# EAGLE design Cap_array_with_Current_Limiter_V1p0 (EAGLE 9.6.2)
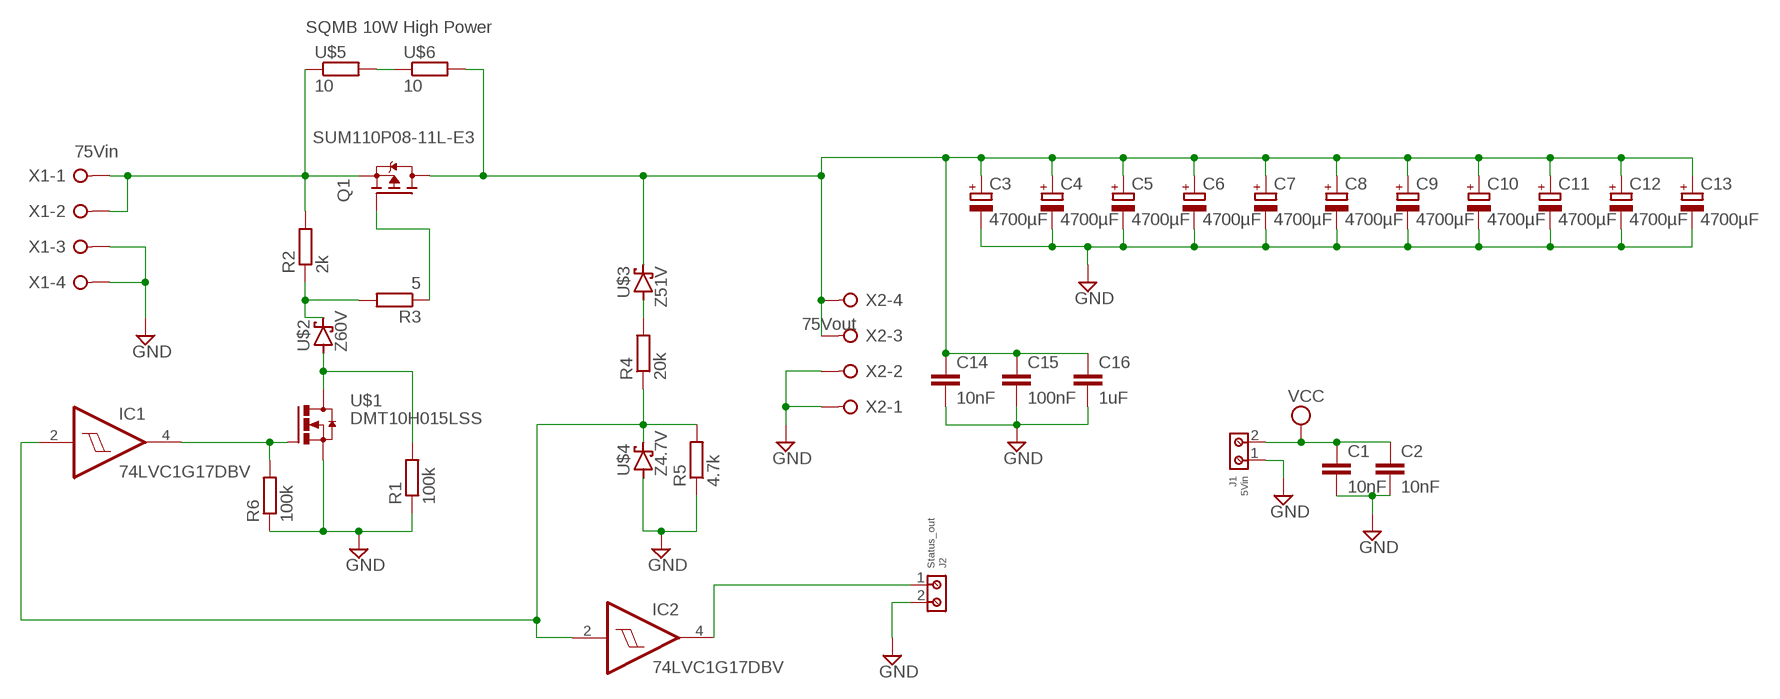
[diagram p0: schematic, sheet 1]

## Parts
C1  10nF  C-EUC0805  [C0805]
C2  10nF  C-EUC0805  [C0805]
C3  4700µF  CPOL-EUE10-30  [EB30D]
C4  4700µF  CPOL-EUE10-30  [EB30D]
C5  4700µF  CPOL-EUE10-30  [EB30D]
C6  4700µF  CPOL-EUE10-30  [EB30D]
C7  4700µF  CPOL-EUE10-30  [EB30D]
C8  4700µF  CPOL-EUE10-30  [EB30D]
C9  4700µF  CPOL-EUE10-30  [EB30D]
C10  4700µF  CPOL-EUE10-30  [EB30D]
C11  4700µF  CPOL-EUE10-30  [EB30D]
C12  4700µF  CPOL-EUE10-30  [EB30D]
C13  4700µF  CPOL-EUE10-30  [EB30D]
C14  10nF  C-EUC1206  [C1206]
C15  100nF  C-EUC1206  [C1206]
C16  1uF  C-EUC1206  [C1206]
IC1  74LVC1G17DBV  [SOT23-5]
IC2  74LVC1G17DBV  [SOT23-5]
J1  5Vin  691210910002  [691210910002]
J2  Status_out  691210910002  [691210910002]
Q1  SUM110P08-11L-E3  SPB80P06P  [TO263]
R1  100k  R-EU_R0805  [R0805]
R2  2k  R-EU_R2512  [R2512]
R3  5  R-EU_R0805  [R0805]
R4  20k  R-EU_R0805  [R0805]
R5  4.7k  R-EU_R0805  [R0805]
R6  100k  R-EU_R0805  [R0805]
U$1  DMT10H015LSS  [SOIC8]
U$2  Z60V  SCHOTTKYDO-214-AA  [DO-214AA]
U$3  Z51V  SCHOTTKYDO-214-AA  [DO-214AA]
U$4  Z4.7V  SCHOTTKYDO-214-AA  [DO-214AA]
U$5  10  SQMB  [SQMB]
U$6  10  SQMB  [SQMB]
X1  75Vin  W237-04P  [W237-4P]
X2  75Vout  W237-04P  [W237-4P]

## Nets
GND: C1.2 C2.2 C3.- C4.- C5.- C6.- C7.- C8.- C9.- C10.- C11.- C12.- C13.- C14.2 C15.2 C16.2 J1.1 J2.2 R1.1 R5.1 R6.1 U$1.1(S) U$1.2(S) U$1.3(S) U$4.A X1.3 X1.4 X2.1 X2.2
N$1: R2.1 R3.2 U$2.C
N$2: Q1.2(S) R2.2 U$5.P$1 X1.1 X1.2
N$3: U$5.P$2 U$6.P$1
N$6: IC1.4(O) R6.2 U$1.4(G)
N$7: Q1.1(G) R3.1
N$8: C3.+ C4.+ C5.+ C6.+ C7.+ C8.+ C9.+ C10.+ C11.+ C12.+ C13.+ C14.1 C15.1 C16.1 Q1.3(D) U$3.C U$6.P$2 X2.3 X2.4
N$9: R4.2 U$3.A
N$10: IC1.2(I) IC2.2(I) R4.1 R5.2 U$4.C
N$15: IC2.4(O) J2.1
N$40: R1.2 U$1.5(D) U$1.6(D) U$1.7(D) U$1.8(D) U$2.A
VCC: C1.1 C2.1 J1.2

## Notes on the sheet
- SQMB 10W High Power

## Power pins joined to a net without a drawn wire
GND: IC1.3(GND) IC2.3(GND)
VCC: IC1.5(VCC) IC2.5(VCC)

## Library data of the parts
C1 C2 C14-C16 = rcl:C-EU: CAPACITOR, European symbol; SPICEPREFIX: C
C3-C13 = rcl:CPOL-EU: POLARIZED CAPACITOR, European symbol; SPICEPREFIX: C
IC1 IC2 = 74xx-little-us:74*1G17: Single Schmitt-Trigger Buffer
J1 J2 = Wurth_Connectors_WR-TBL Rising Cage Clamp:691210910002: WR-TBL Serie 2109 - 2.54 mm Horiz. Entry KIND PROPERTIES Pitch 2.54 mm MATERIAL PROPERTIES Insulator Material PA66 Insulator Flammability Rating UL94 V-0 Insulator Color Green Contact Material Brass Contact Plating Copper over Zinc Terminal Screw Material Steel Terminal Screw Plating Zinc Wire Guard Material Brass GENERAL INFORMATION Operating Temperature -40 up to +105 °C Compliance Lead free / RoHS ELECTRICAL PROPERTIES IR cULus 6 A Working Voltage [cULus] 150 V (AC) Withstanding Voltage [cULus] 1300 V (AC) Contact Resistance [cULus] 20 mΩ MECHANICAL PROPERTIES Wire Strip Length 4 up to 5 (mm) Screw M1.6 Solid Wire Section (AWG) 30 to 18 (AWG) Solid Wire Section (Metric) 0.0509 to 0.823 (mm²) Stranded Wire Section (AWG) 30 to 18 (AWG) Stranded Wire Section (Metric) 0.0509 to 0.823 (mm²) CERTIFICATION cULus Approval E315414 PACKAGING PROPERTIES Packaging Box <https://katalog.we-online.com/media/images/v2/o33231v209%20Family_WR-TBL_69121091000x.jpg> Details see: https://katalog.we-online.com/en/em/TBL_2_54_2109_HORIZONTAL_ENTRY_69121091000X Updated by Ella Wu 2019-11-12 2019(C) Wurth Elektronik; DATASHEET-URL: https://www.we-online.com/catalog/datasheet/691210910002.pdf; IR-UL: 6A; MOUNT: THT; PART-NUMBER: 691210910002; PINS: 2; PITCH: 2.54mm; TYPE: Horizontal; WIRE: 30 to 18 (AWG) 0.0509 to 0.823 (mm²); WORKING-VOLTAGE-UL: 150V (AC)
Q1 = transistor-fet:SPB80P06P: SIPMOS (R) Power-Transistor P-Channel, Enhancement mode Source: http://www.infineon.com/upload/Document/cmc_upload/documents/011/3685/SPP80P06P.pdf
R1-R6 = rcl:R-EU_: RESISTOR, European symbol; SPICEPREFIX: R
U$1 = Orzada:DMT10H015LSS
U$2-U$4 = Orzada:SCHOTTKY
U$5 U$6 = Orzada:SQMB: SQMB Cement Housed High Power Resistor - Pulse Withstand
X1 X2 = con-wago-508:W237-04P: WAGO SREW CLAMP; OC_FARNELL: unknown; OC_NEWARK: unknown

## Board
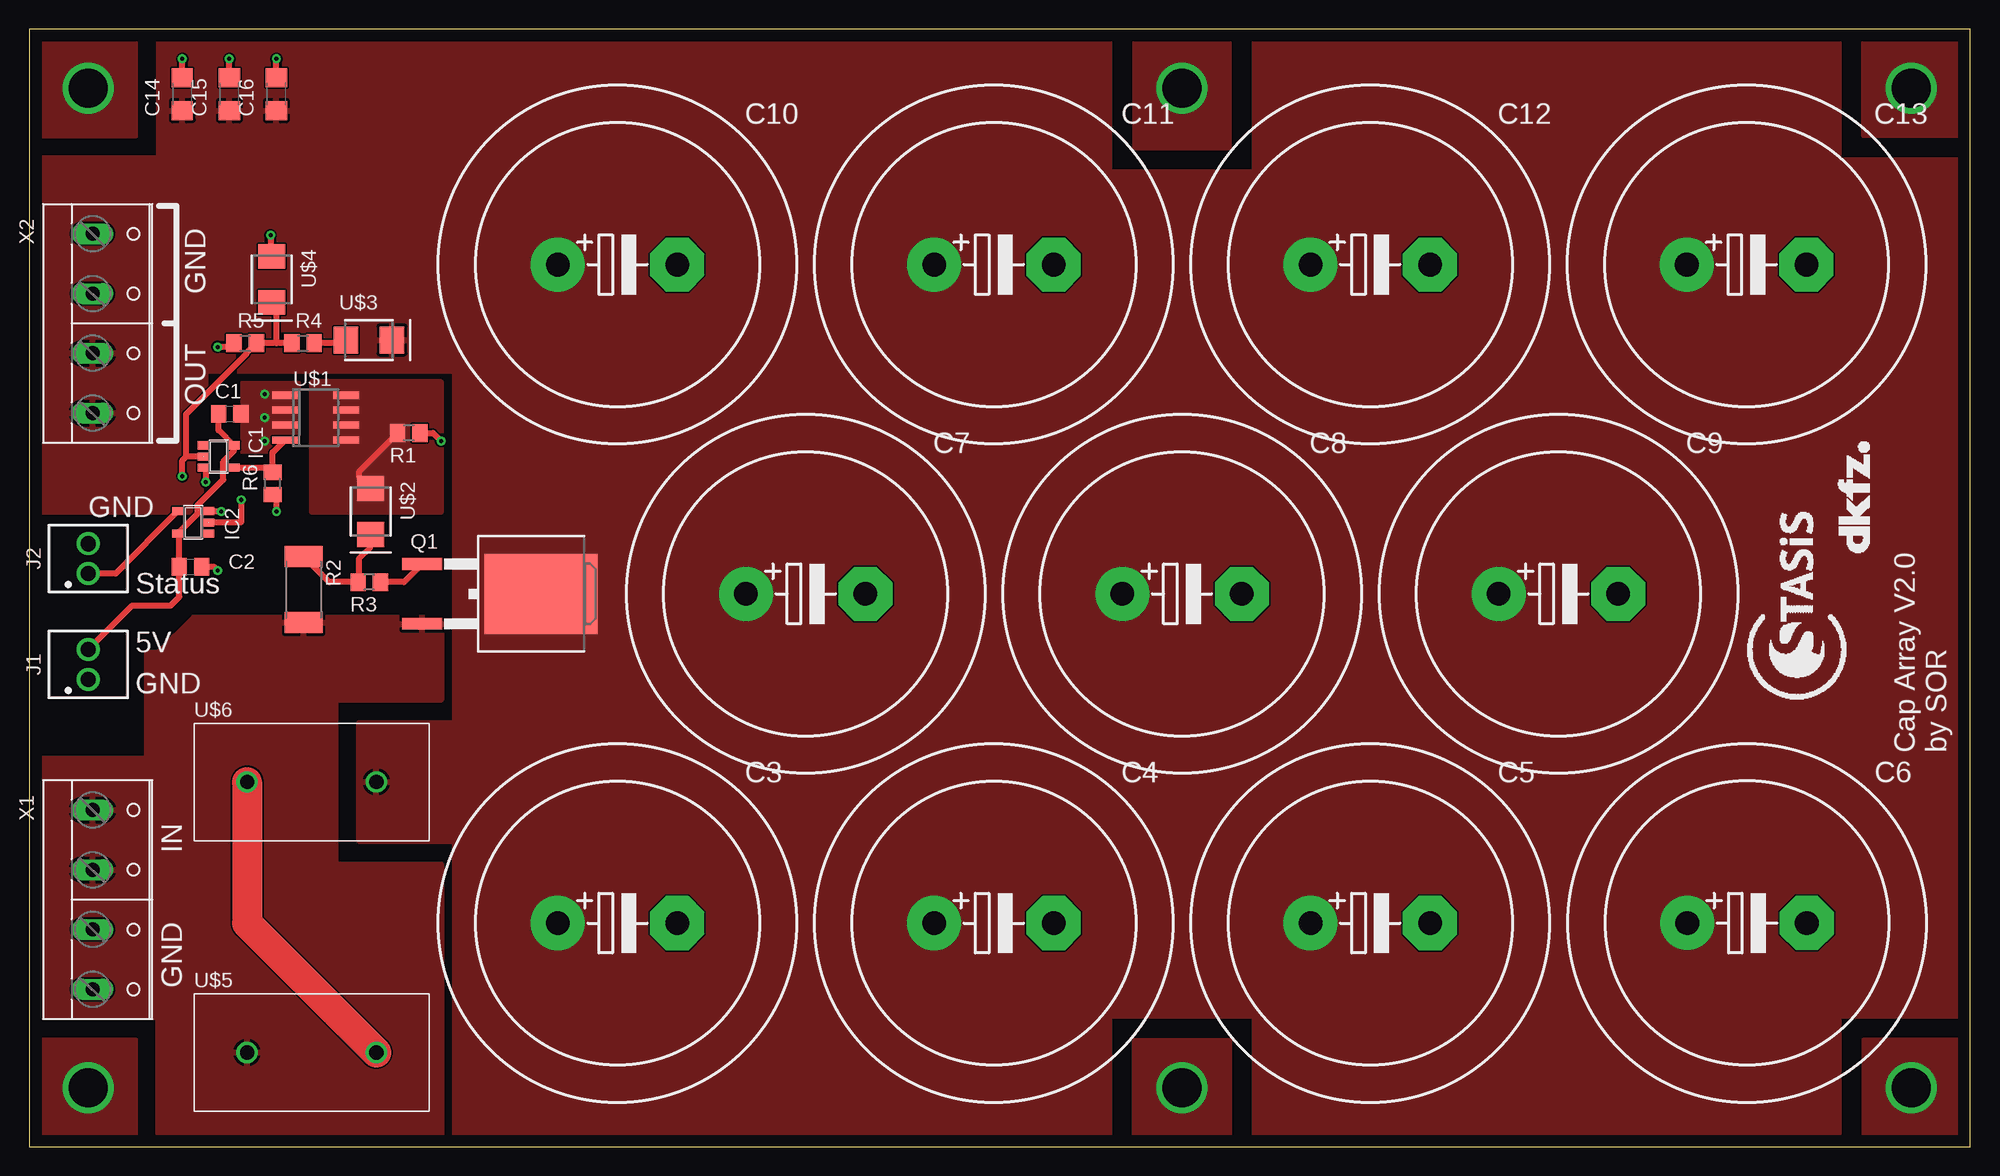
[diagram p1: board, top side]
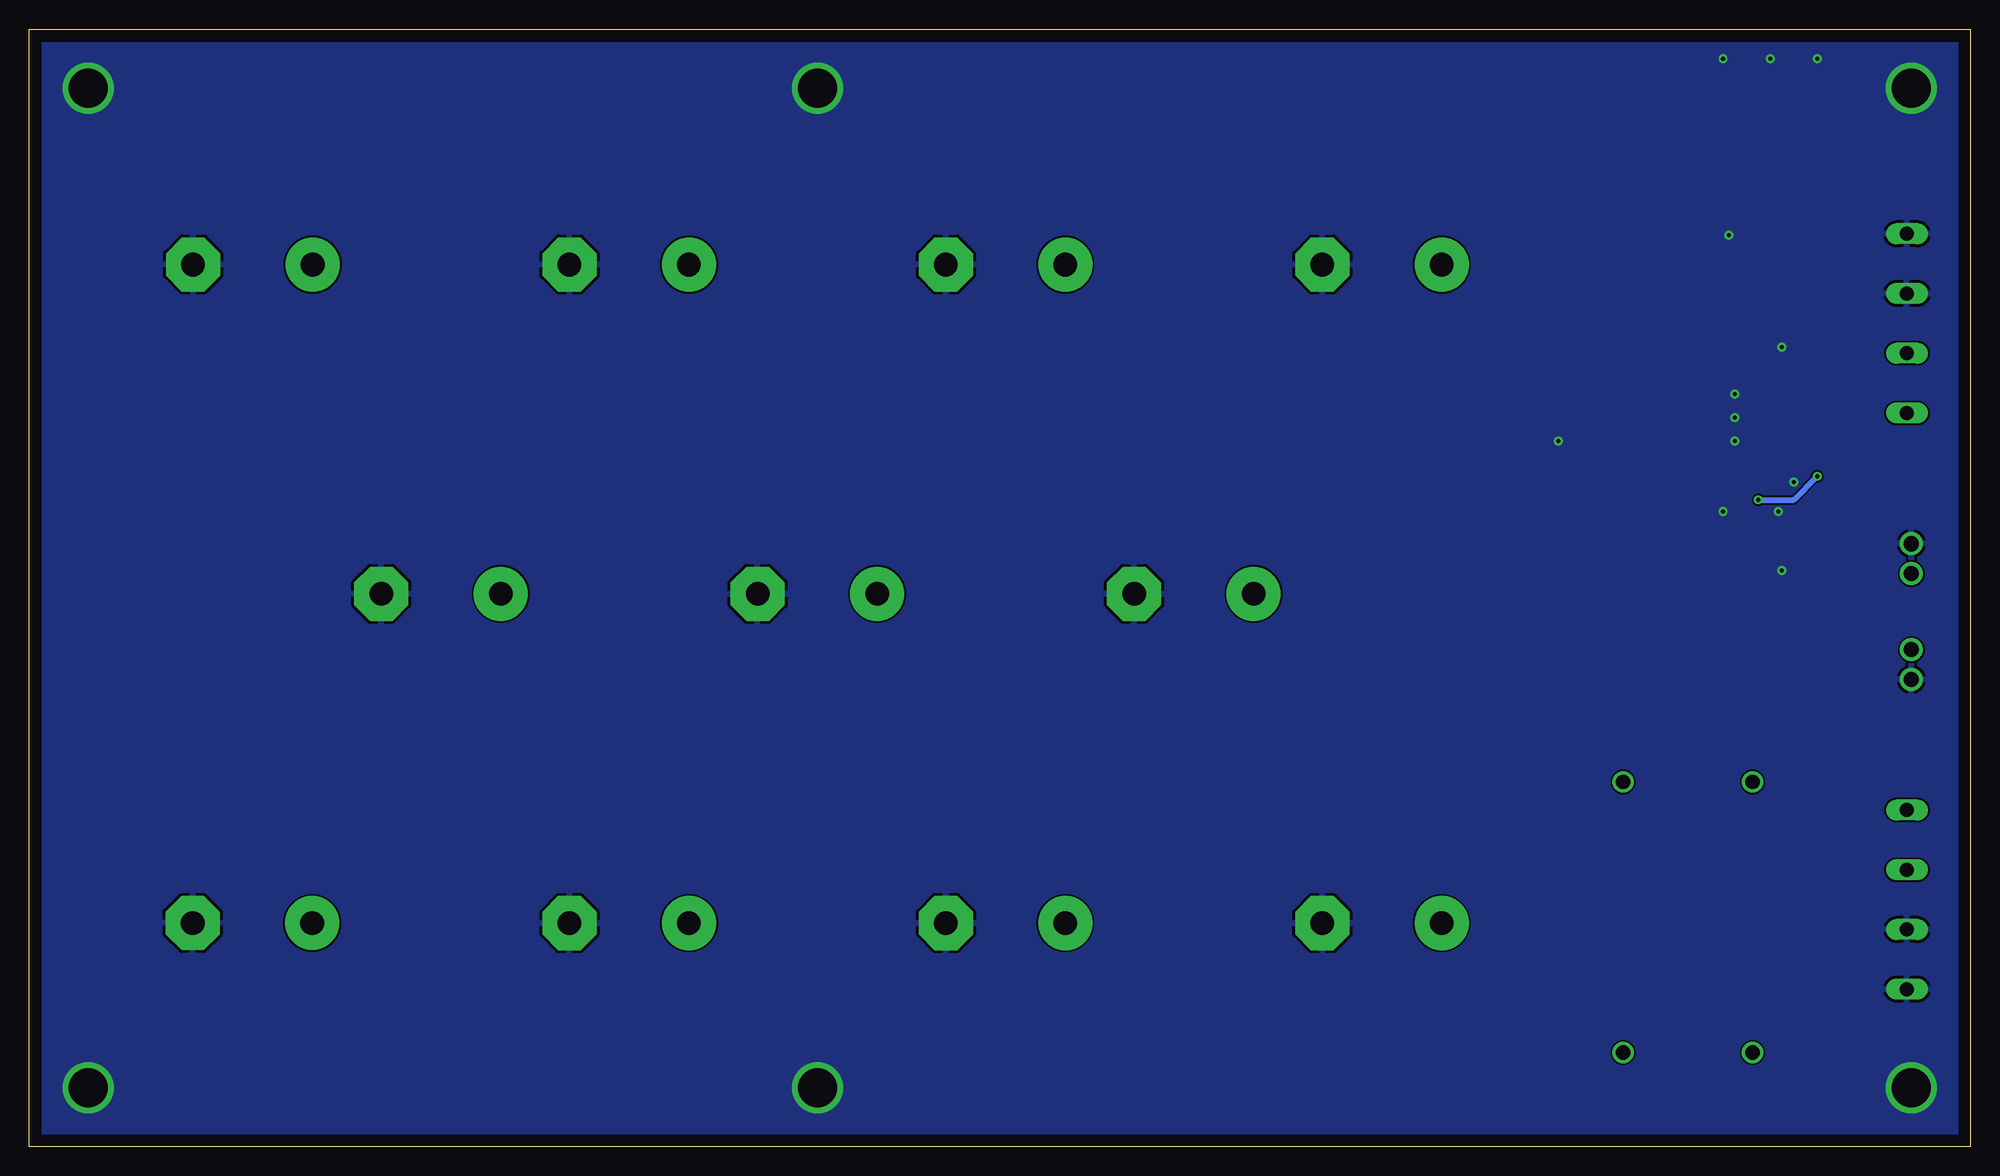
[diagram p2: board, bottom side, seen from below]

Size 165 x 95 mm. Coordinates in mm from the lower left corner, seen from the top.
Outline: 0,0 165,0 165,95 0,95 0,0
Copper layers (1*16): Top 0.035mm / dielectric 1.5mm / Bottom 0.035mm
Design rules "default": minimum track width 6mil, minimum drill 0.35mm, track to track 6mil, track to pad 6mil, pad to pad 6mil, via to via 6mil, smd to smd 6mil, copper to edge 40mil, drill to drill 6mil, minimum pad ring 10mil, minimum via ring 8mil, stop-mask expansion 4mil, vias tented up to drill 0mil, thermal gap 10mil

### Footprints (pad centres in the part's own frame; a part is rotated, then mirrored left to right if it is on the bottom)
C0805 = smd 1.3 x 1.5: 1 -0.95,0; 2 0.95,0
EB30D = drill 2.007 pad 4.597: + -5.08,0 | drill 2.007 pad 4.597 octagon: - 5.08,0
C1206 = smd 1.6 x 1.8: 1 -1.4,0; 2 1.4,0
SOT23-5 = smd 0.69 x 0.99: 1 -0.95,-1.29; 2 0,-1.29; 3 0.95,-1.29; 4 0.95,1.3; 5 -0.95,1.3
691210910002 = drill 1.3: 1 -1.27,0; 2 1.27,0
TO263 = smd 1 x 3.4: 1 -2.54,-6.6; 2 2.54,-6.6 | smd 6.8 x 9.6: 3 0,3.5
R0805 = smd 1.3 x 1.5: 1 -0.95,0; 2 0.95,0
R2512 = smd 1.8 x 3.2: 1 -2.8,0; 2 2.8,0
SOIC8 = smd 0.6 x 2.2: 1 -1.905,-2.6; 2 -0.635,-2.6; 3 0.635,-2.6; 4 1.905,-2.6; 5 1.905,2.6; 6 0.635,2.6; 7 -0.635,2.6; 8 -1.905,2.6
DO-214AA = smd 2.1 x 2.3: A -1.95,0; C 1.95,0
SQMB = drill 1.2: P$1 -5.5,0; P$2 5.5,0
W237-4P = drill 1.194 long: 1 -7.62,-0.635; 2 -2.54,-0.635; 3 2.54,-0.635; 4 7.62,-0.635

### Placement (x,y rotation side)
C1  17.04,62.32 0 top
C2  13.69,49.32 0 top
C3  50,19 0 top
C4  82,19 0 top
C5  114,19 0 top
C6  146.04,19.01 0 top
C7  66,47 0 top
C8  98,47 0 top
C9  130,47 0 top
C10  50,75 0 top
C11  82,75 0 top
C12  114,75 0 top
C13  146,75 0 top
C14  13,89.5 90 top
C15  17,89.5 90 top
C16  21,89.5 90 top
IC1  16.08,58.68 270 top
IC2  13.92,53.08 90 top
J1  5,41 90 top
J2  5,50 90 top
Q1  40,47 270 top
R1  32.26,60.68 180 top
R2  23.32,47.37 270 top
R3  28.9,48 180 top
R4  23.26,68.32 0 top
R5  18.34,68.32 0 top
R6  20.68,56.39 90 top
U$1  24.33,61.98 270 top
U$2  29,54 270 top
U$3  28.87,68.59 0 top
U$4  20.59,73.75 270 top
U$5  24,8 0 top
U$6  24,31 0 top
U$7  [LOGO_STASIS]  150.5,47 90 top
U$8  [LOGO_DKFZ]  156.5,50.5 90 top
X1  6,21 270 top
X2  6,70 270 top

### Tracks (layer width: path | path; a pad name or v marks a point on that pad's centre or on a via)
GND  (via drill 0.35, 3.3)
  Top 0.508: v20.5,77.5 20.5,75.79 U$4.A | R5.1 17.07,68 v16,68 | R1.1 34.32,60.68 v35,60 | C2.2 15.68,49.32 v16,49 | C16.2 v21,92.5 | C15.2 v17,92.5 | C14.2 v13,92.5 | R6.1 21,55.12 v21,54 | IC1.3 15,57.52 v15,56.5 | IC2.3 16.27,54.03 v16.3,54
  other vias: 20,64 20,62 20,60 5,5 98,5 98,90 160,5 160,90 5,90
  pour Bottom: 1,94 164,94 164,1 1,1
  pour Top (no thermals): 18,65 18,59 23,59 23,65
  pour Top: 94,94 94,85 102,85 102,94
  pour Top: 164,86 156,86 156,94 164,94
  pour Top: 1,94 1,86 9,86 9,94
  pour Top: 1,1 9,1 9,9 1,9
  pour Top: 94,1 94,9 102,9 102,1
  pour Top: 156,9 156,1 164,1 164,9
N$1
  Top 0.508: R2.1 25.49,48 R3.2 28,48 28,50 29,51 U$2.C
N$2
  pour Top: 35,1 11,1 11,11 1,11 1,33 10,33 10,42 11,42 14,45 35,45 35,38 26,38 26,24 35,24
N$3
  Top 2.54: U$5.P$2 18.5,19 U$6.P$1
N$6
  Top 0.508: IC1.4 20.29,57.73 R6.2 20.68,59.02 U$1.4
N$7
  Top 0.508: Q1.1 31.86,48 R3.1
N$8
  pour Top (no thermals): 36,94 36,1 92,1 92,11 104,11 104,1 154,1 154,11 164,11 164,84 154,84 154,94 104,94 104,83 92,83 92,94
  pour Top: 36,36 28,36 28,26 36,26
  pour Top: 37,94 11,94 11,84 1,84 1,54 15,54 15,66 37,66
N$9
  Top 0.508: U$3.A 26.65,68.32 R4.2
N$10  (via drill 0.35)
  Top 0.508: R4.1 21,68.32 | 21,68.32 R5.2 18.45,67.48 18.45,67.4 13.32,62.28 13.32,58.68 | U$4.C 21,71.39 21,68.32 | IC2.2 18,53.08 v18,55 | 13.32,58.68 13,58.35 v13,57 | IC1.2 13.32,58.68
  Bottom 0.508: v18,55 15,55 v13,57
N$15
  Top 0.508: IC2.4 7.32,48.73 J2.1
N$40
  Top 0.508: U$2.A 28,56.95 28,57.37 R1.2
  pour Top (no thermals): 24,65 24,54 35,54 35,65
VCC
  Top 0.508: J1.2 8.73,46 12,46 12.74,46.74 C2.1 12.74,52.01 IC2.5 14.31,53.82 14.31,54.54 16.48,56.71 16.48,58.24 17.38,59.15 IC1.5 16.09,60.92 C1.1

### Text on the board
tPlace: GND | OUT | GND | Status | 5V | GND | Cap Array V2.0 / by SOR | IN | GND